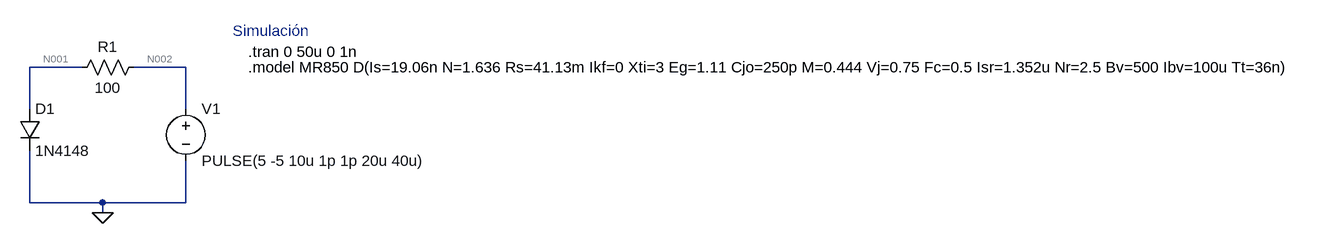
[diagram p0: schematic TPT2 - Diodos de Potencia vs Señal.asc]
TPT2 - Diodos de Potencia vs Señal.asc, the LTspice schematic file:
Version 4
SHEET 1 2008 680
WIRE -64 16 -144 16
WIRE 96 16 16 16
WIRE -144 80 -144 16
WIRE 96 80 96 16
WIRE -144 224 -144 144
WIRE -32 224 -144 224
WIRE 96 224 96 160
WIRE 96 224 -32 224
WIRE -32 240 -32 224
FLAG -32 240 0
SYMBOL voltage 96 64 R0
WINDOW 123 0 0 Left 0
WINDOW 39 0 0 Left 0
SYMATTR InstName V1
SYMATTR Value PULSE(5 -5 10u 1p 1p 20u 40u)
SYMBOL res 32 0 R90
WINDOW 0 0 56 VBottom 2
WINDOW 3 32 56 VTop 2
SYMATTR InstName R1
SYMATTR Value 100
SYMBOL diode -160 80 R0
SYMATTR InstName D1
SYMATTR Value 1N4148
TEXT 168 -40 Left 2 ;Simulación
TEXT 192 -8 Left 2 !.tran 0 50u 0 1n
TEXT 192 16 Left 2 !.model MR850 D(Is=19.06n N=1.636 Rs=41.13m Ikf=0 Xti=3 Eg=1.11 Cjo=250p M=0.444 Vj=0.75 Fc=0.5 Isr=1.352u Nr=2.5 Bv=500 Ibv=100u Tt=36n)

The netlist it stands for:
* TPT2 - Diodos de Potencia vs Señal.asc
V1 N002 0 PULSE(5 -5 10u 1p 1p 20u 40u)
R1 N002 N001 100
D1 N001 0 1N4148
.model D D
.lib standard.dio
* Simulación
.tran 0 50u 0 1n
.model MR850 D(Is=19.06n N=1.636 Rs=41.13m Ikf=0 Xti=3 Eg=1.11 Cjo=250p M=0.444 Vj=0.75 Fc=0.5 Isr=1.352u Nr=2.5 Bv=500 Ibv=100u Tt=36n)
.backanno
.end

* Results of the author's LTspice run, read from the files saved beside the schematic
* Operating Point, zero values left out:
*   V(n002) = 5 V
*   V(n001) = 777.8 mV
*   I(D1) = 42.22 mA
*   I(R1) = 42.22 mA
*   I(V1) = -42.22 mA
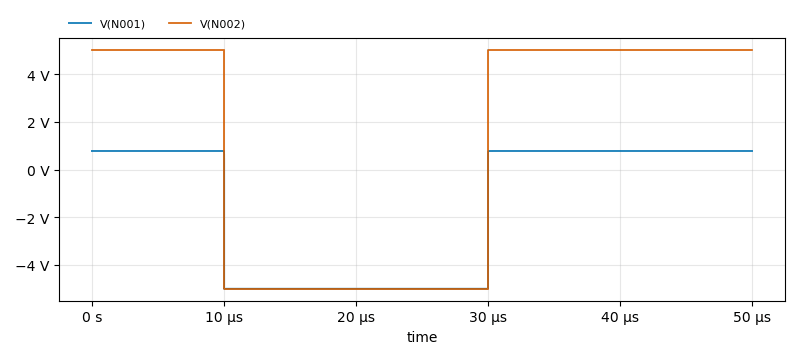
[diagram p1: Transient Analysis of TPT2 - Diodos de Potencia vs Señal.asc, plotted from the saved traces]
* Transient Analysis, 1 run:
*   V(N001): min -5.005 V, max 777.8 mV, average -1.532 V, rms 3.218 V, last 777.8 mV
*   V(N002): min -5 V, max 5 V, average 1 V, rms 5 V, last 5 V